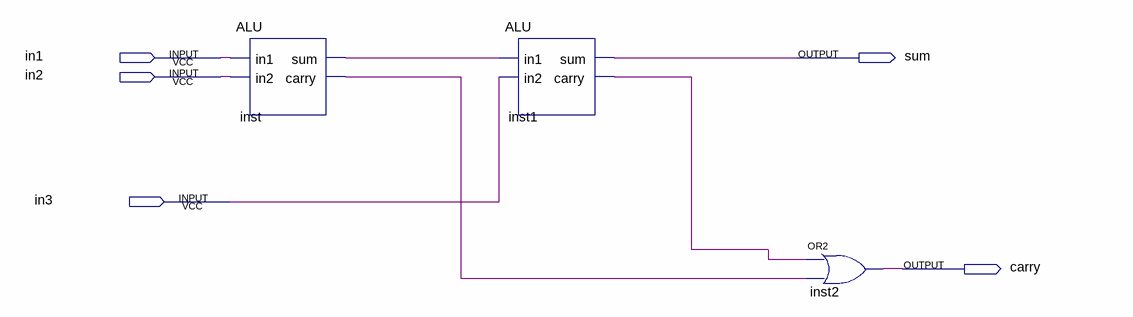
[diagram p0: schematic sheet]
// Quartus schematic Block2.bdf as structural Verilog: 3 symbols, 5 pins
module Block2 (
  input  in1,
  input  in2,
  input  in3,
  output sum,
  output carry
);

  wire inst1_carry, inst_carry, inst_sum;

  ALU inst (.in1(in1), .in2(in2), .sum(inst_sum), .carry(inst_carry));
  ALU inst1 (.in1(inst_sum), .in2(in3), .sum(sum), .carry(inst1_carry));
  or inst2 (carry, inst1_carry, inst_carry);
endmodule
